# Altium schematic sheet _power.SchDoc
size Tabloid
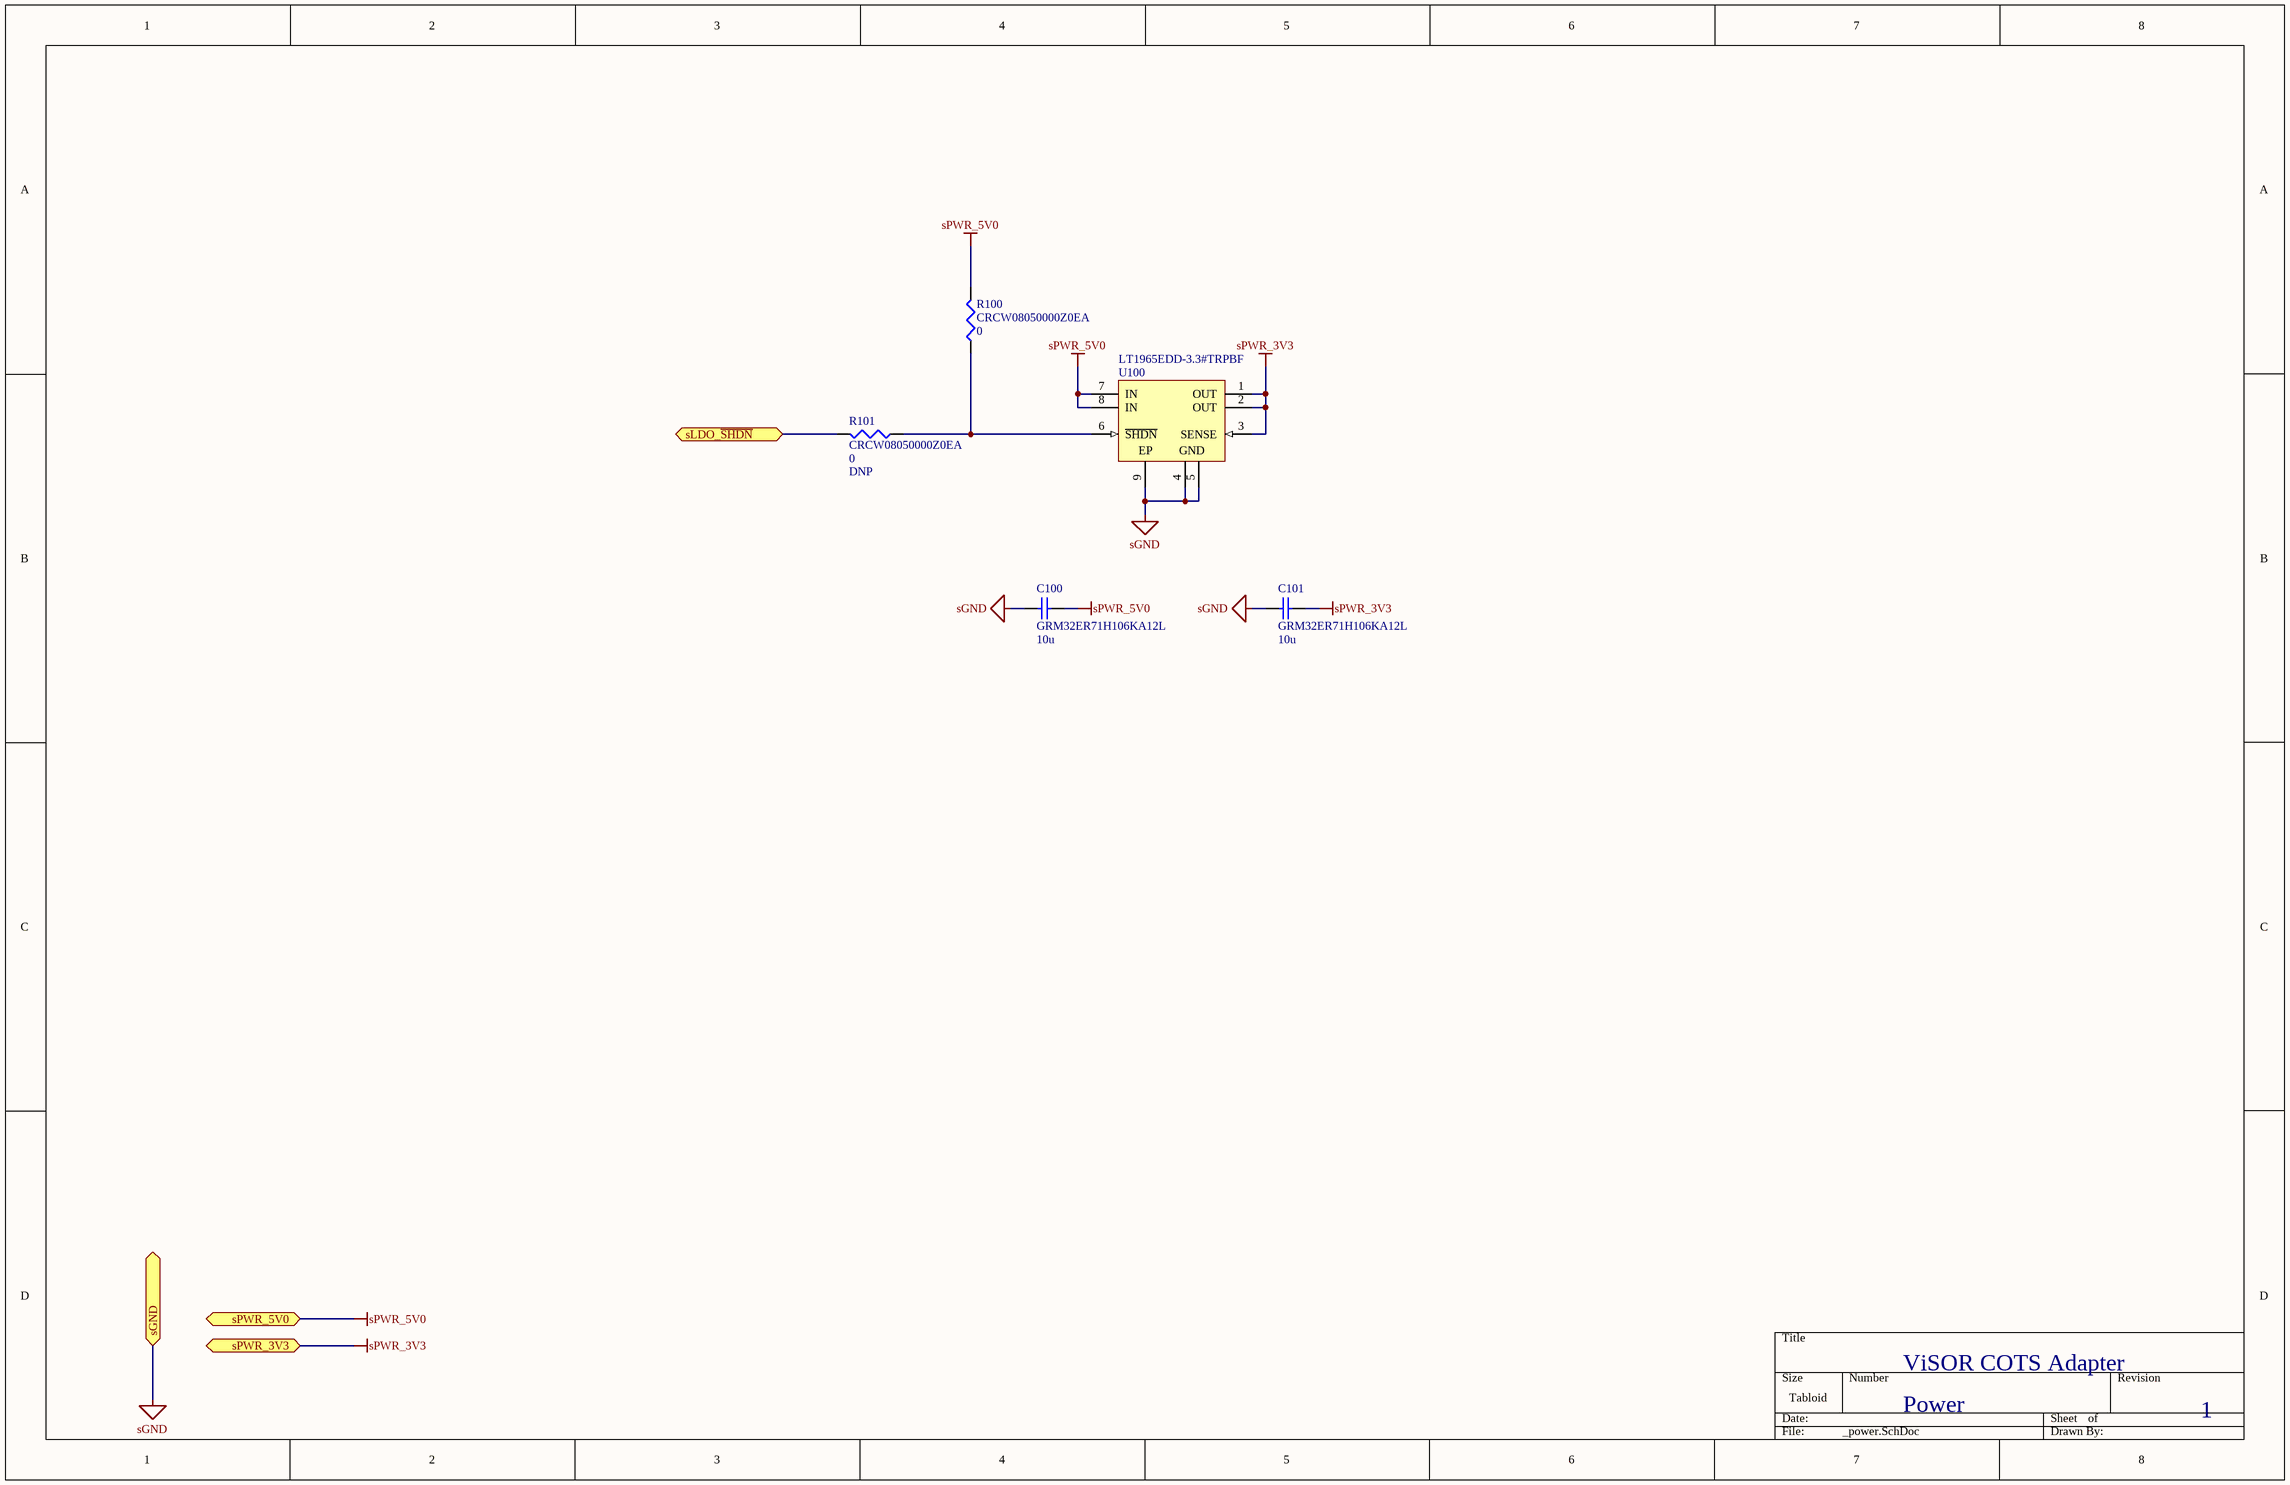
[diagram p0: _power.SchDoc]

## Parts
C100  GRM32ER71H106KA12L  value 10u  [1210]
C101  GRM32ER71H106KA12L  value 10u  [1210]
R100  CRCW08050000Z0EA  value 0  [6-0805_M]
R101  CRCW08050000Z0EA  value 0  [6-0805_M]
U100  LT1965EDD-3.3#TRPBF  [LT-DD-8_V - MOD]

## Ports
sGND, sLDO_~{SHDN}, sPWR_3V3, sPWR_5V0

## Nets
sGND: C100.1 C101.1 U100.4(GND) U100.5(GND) U100.9(EP) ; port sGND
sPWR_3V3: C101.2 U100.1(OUT) U100.2(OUT) U100.3(SENSE) ; port sPWR_3V3
sPWR_5V0: C100.2 R100.2 U100.7(IN) U100.8(IN) ; port sPWR_5V0
sLDO_~{SHDN}: R101.2 ; port sLDO_~{SHDN}
NetR100_1: R100.1 R101.1 U100.6(~{SHDN})

## Notes on the sheet
- ViSOR COTS Adapter
- Power
- 1
- (in symbol Res3) DNP

## Library data of the parts
C100 C101 = GRM32ER71HxxxKdddd: -55-125C, 1005, 50V, X7R, ±10%
R100 R101 = Res3: 0Ω Resistor; Published: 8-Jun-2000; LatestRevisionDate: 29-May-2009; LatestRevisionNote: IPC-7351 Footprint Added.; PackageReference: J1-0603; Publisher: Altium Limited; PackageDescription: Chip Resistor
U100 = LT1965EDD-3.3#TRPBF: 1.1 A, Low Noise, Low Dropout Linear Regulator, 1.8 to 20 V Vin, 3.3 V Vout, 8-pin SON (DD-8), -40 to 125 degC, Pb-Free, Tape and Reel; Manufacturer: Linear Technology; Discrete Pass Element: no; Dropout Voltage(V): 0.31; Iout(mA): 1100; Isupply(mA): 0.5; Noise(uV): 40; Number of Outputs: 1; Output Voltage: 3.3 V; PSRR(dB): 75; Vin Max(V): 20; Vin Min(V): 1.8; DatasheetVersion: Rev. A; PackageVersion: Jun-10; PackageReference: DD-8; PackageDescription: 8-Pin Plastic DFN, Body 3 x 3 mm, Pitch 0.5 mm; Supplier 1: Digi-Key; Supplier Part Number 1: LT1965EDD-3.3#TRPBF-ND; Packing: Tape and Reel; RoHS: TRUE; Shutdown Current(uA): 1; Mounting Technology: Surface Mount; Code_JEDEC: MO-229; PartNumber: LT1965EDD-3.3#TRPBF; ComponentLink1Description: Manufacturer URL; ComponentLink1URL: http://www.linear.com/; ComponentLink2Description: Datasheet; ComponentLink2URL: http://cds.linear.com/docs/en/datasheet/1965fa.pdf; ComponentLink3Description: Package Specification; ComponentLink3URL: http://cds.linear.com/docs/en/packaging/DFN_8_05-08-1698.pdf